# Altium schematic sheet shift.SchDoc
size A1
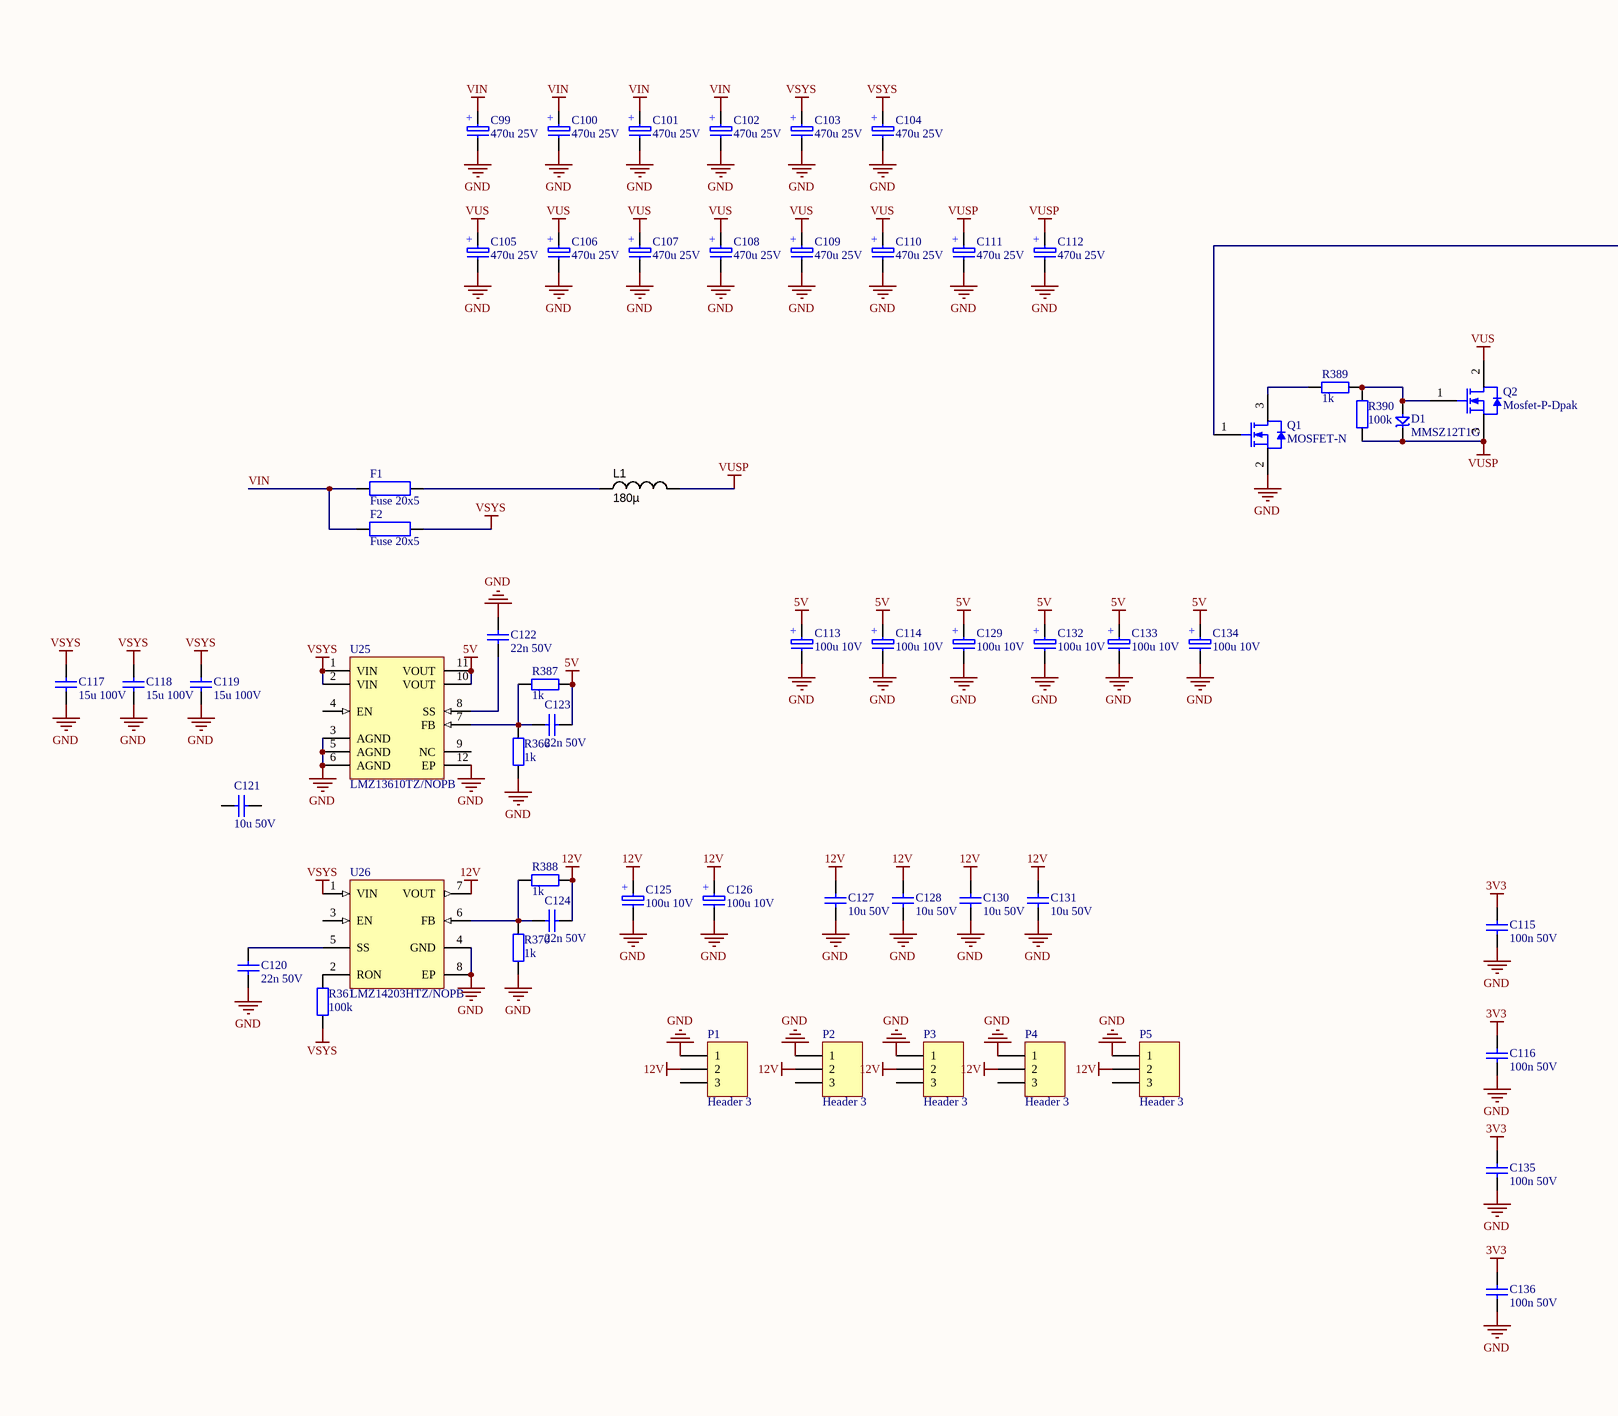
[diagram p0: shift.SchDoc, left]
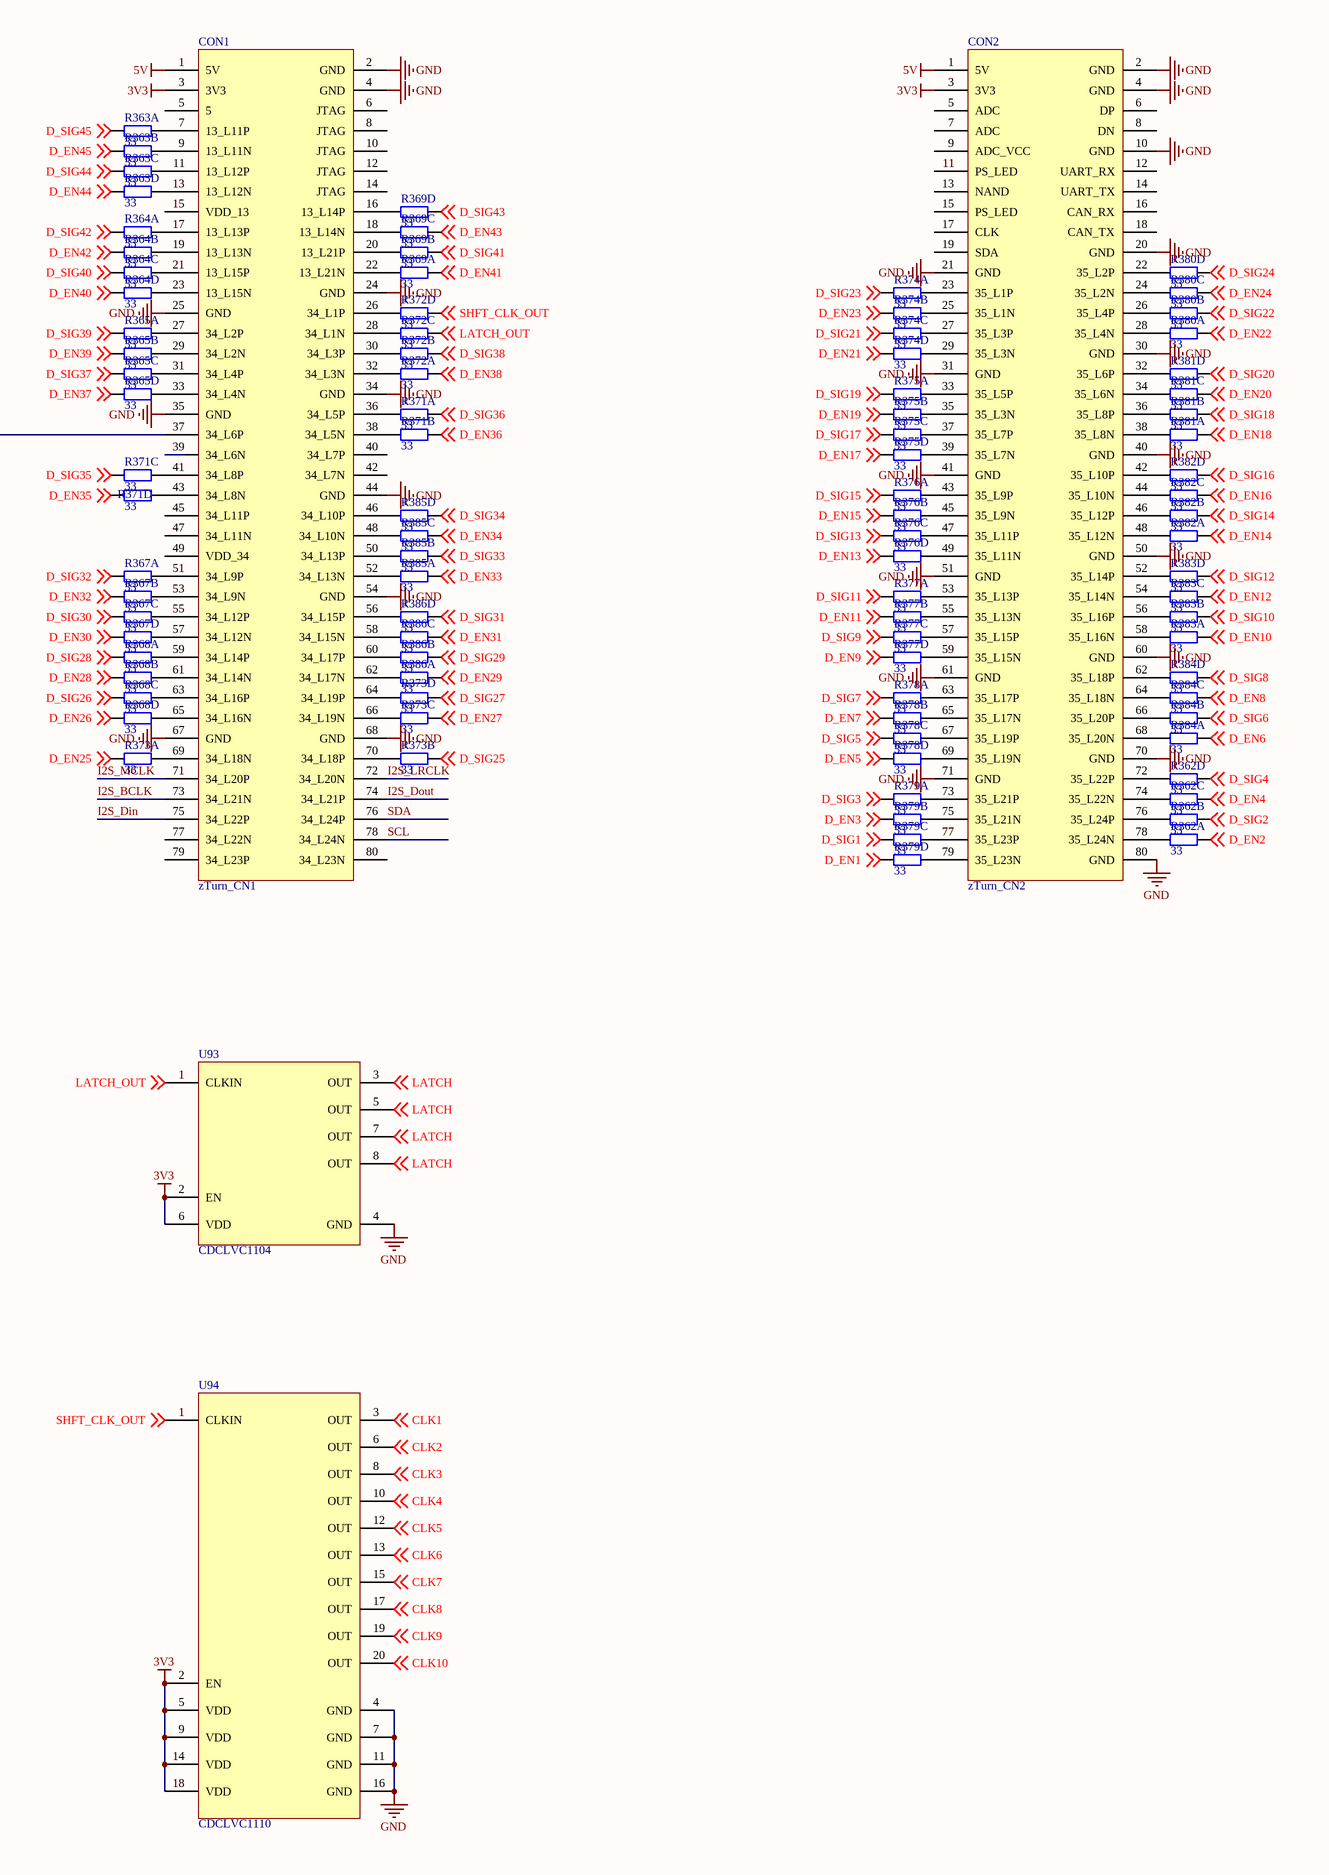
[diagram p1: shift.SchDoc, right]

## Parts
C99  470u 25V  [SMD-10x10]
C100  470u 25V  [SMD-10x10]
C101  470u 25V  [SMD-10x10]
C102  470u 25V  [SMD-10x10]
C103  470u 25V  [SMD-10x10]
C104  470u 25V  [SMD-10x10]
C105  470u 25V  [SMD-10x10]
C106  470u 25V  [SMD-10x10]
C107  470u 25V  [SMD-10x10]
C108  470u 25V  [SMD-10x10]
C109  470u 25V  [SMD-10x10]
C110  470u 25V  [SMD-10x10]
C111  470u 25V  [SMD-10x10]
C112  470u 25V  [SMD-10x10]
C113  100u 10V  [C-TANT-C 2.8mm]
C114  100u 10V  [C-TANT-C 2.8mm]
C115  100n 50V  [C-0603-M]
C116  100n 50V  [C-0603-M]
C117  15u 100V  [C-2220]
C118  15u 100V  [C-2220]
C119  15u 100V  [C-2220]
C120  22n 50V  [C-0603-H]
C121  10u 50V  [C-1206-H]
C122  22n 50V  [C-0603-H]
C123  22n 50V  [C-0603-H]
C124  22n 50V  [C-0603-H]
C125  100u 10V  [C-TANT-C 2.8mm]
C126  100u 10V  [C-TANT-C 2.8mm]
C127  10u 50V  [C-1206-H]
C128  10u 50V  [C-1206-H]
C129  100u 10V  [C-TANT-C 2.8mm]
C130  10u 50V  [C-1206-H]
C131  10u 50V  [C-1206-H]
C132  100u 10V  [C-TANT-C 2.8mm]
C133  100u 10V  [C-TANT-C 2.8mm]
C134  100u 10V  [C-TANT-C 2.8mm]
C135  100n 50V  [C-0603-M]
C136  100n 50V  [C-0603-M]
CON1  zTurn_CN1  [zTurn]
CON2  zTurn_CN2  [zTurn]
D1  MMSZ12T1G  [SOD123]
F1  Fuse 20x5  [FUSE-22.5]
F2  Fuse 20x5  [FUSE-22.5]
L1  value 180µ  [IND_SMD_TOROID_1.2x1.0in]  (hidden comment: INDC_180u_Toroid)
P1  Header 3  [HDR1X3]
P2  Header 3  [HDR1X3]
P3  Header 3  [HDR1X3]
P4  Header 3  [HDR1X3]
P5  Header 3  [HDR1X3]
Q1  MOSFET-N  [SOT-23]
Q2  Mosfet-P-Dpak  [DPAK]
R361  100k  [R-0603-H]
R362  33  [CAC-50P200X100-8N]  (parts A,B,C,D of 4)
R363  33  [CAC-50P200X100-8N]  (parts A,B,C,D of 4)
R364  33  [CAC-50P200X100-8N]  (parts A,B,C,D of 4)
R365  33  [CAC-50P200X100-8N]  (parts A,B,C,D of 4)
R366  1k  [R-0603-H]
R367  33  [CAC-50P200X100-8N]  (parts A,B,C,D of 4)
R368  33  [CAC-50P200X100-8N]  (parts A,B,C,D of 4)
R369  33  [CAC-50P200X100-8N]  (parts A,B,C,D of 4)
R370  1k  [R-0603-H]
R371  33  [CAC-50P200X100-8N]  (parts A,B,C,D of 4)
R372  33  [CAC-50P200X100-8N]  (parts A,B,C,D of 4)
R373  33  [CAC-50P200X100-8N]  (parts A,B,C,D of 4)
R374  33  [CAC-50P200X100-8N]  (parts A,B,C,D of 4)
R375  33  [CAC-50P200X100-8N]  (parts A,B,C,D of 4)
R376  33  [CAC-50P200X100-8N]  (parts A,B,C,D of 4)
R377  33  [CAC-50P200X100-8N]  (parts A,B,C,D of 4)
R378  33  [CAC-50P200X100-8N]  (parts A,B,C,D of 4)
R379  33  [CAC-50P200X100-8N]  (parts A,B,C,D of 4)
R380  33  [CAC-50P200X100-8N]  (parts A,B,C,D of 4)
R381  33  [CAC-50P200X100-8N]  (parts A,B,C,D of 4)
R382  33  [CAC-50P200X100-8N]  (parts A,B,C,D of 4)
R383  33  [CAC-50P200X100-8N]  (parts A,B,C,D of 4)
R384  33  [CAC-50P200X100-8N]  (parts A,B,C,D of 4)
R385  33  [CAC-50P200X100-8N]  (parts A,B,C,D of 4)
R386  33  [CAC-50P200X100-8N]  (parts A,B,C,D of 4)
R387  1k  [R-0603-H]
R388  1k  [R-0603-H]
R389  1k  [R-0603-H]
R390  100k  [R-0603-H]
U25  LMZ13610TZ/NOPB  [NDY0011A_M]
U26  LMZ14203HTZ/NOPB  [NDW0007A_V]
U93  CDCLVC1104  [TSSOP65P640X120-8N]
U94  CDCLVC1110  [TSSOP20]

## Nets
3V3: C115.2 C116.2 C135.2 C136.2 CON1.3(3V3) CON2.3(3V3) U93.2(EN) U93.6(VDD) U94.2(EN) U94.5(VDD) U94.9(VDD) U94.14(VDD) U94.18(VDD)
5V: C113.2 C114.2 C123.2 C129.2 C132.2 C133.2 C134.2 CON1.1(5V) CON2.1(5V) R387.2 U25.10(VOUT) U25.11(VOUT)
12V: C124.2 C125.2 C126.2 C127.1 C128.1 C130.1 C131.1 P1.2 P2.2 P3.2 P4.2 P5.2 R388.2 U26.7(VOUT)
GND: C99.1 C100.1 C101.1 C102.1 C103.1 C104.1 C105.1 C106.1 C107.1 C108.1 C109.1 C110.1 C111.1 C112.1 C113.1 C114.1 C115.1 C116.1 C117.1 C118.1 C119.1 C120.1 C122.1 C125.1 C126.1 C127.2 C128.2 C129.1 C130.2 C131.2 C132.1 C133.1 C134.1 C135.1 C136.1 CON1.2(GND) CON1.4(GND) CON1.24(GND) CON1.25(GND) CON1.34(GND) CON1.35(GND) CON1.44(GND) CON1.54(GND) CON1.67(GND) CON1.68(GND) CON2.2(GND) CON2.4(GND) CON2.10(GND) CON2.20(GND) CON2.21(GND) CON2.30(GND) CON2.31(GND) CON2.40(GND) CON2.41(GND) CON2.50(GND) CON2.51(GND) CON2.60(GND) CON2.61(GND) CON2.70(GND) CON2.71(GND) CON2.80(GND) P1.1 P2.1 P3.1 P4.1 P5.1 Q1.2 R366.1 R370.1 U25.3(AGND) U25.5(AGND) U25.6(AGND) U25.12(EP) U26.4(GND) U26.8(EP) U93.4(GND) U94.4(GND) U94.7(GND) U94.11(GND) U94.16(GND)
VIN: C99.2 C100.2 C101.2 C102.2 F1.1(V+) F2.1(V+)
VSYS: C103.2 C104.2 C117.2 C118.2 C119.2 F2.2(V+) R361.1 U25.1(VIN) U25.2(VIN) U26.1(VIN)
VUS: C105.2 C106.2 C107.2 C108.2 C109.2 C110.2 Q2.2
VUSP: C111.2 C112.2 D1.2(kt) L1.2 Q2.3 R390.1
CLK1: U94.3(OUT) ; off-sheet CLK1
CLK2: U94.6(OUT) ; off-sheet CLK2
CLK3: U94.8(OUT) ; off-sheet CLK3
CLK4: U94.10(OUT) ; off-sheet CLK4
CLK5: U94.12(OUT) ; off-sheet CLK5
CLK6: U94.13(OUT) ; off-sheet CLK6
CLK7: U94.15(OUT) ; off-sheet CLK7
CLK8: U94.17(OUT) ; off-sheet CLK8
CLK9: U94.19(OUT) ; off-sheet CLK9
CLK10: U94.20(OUT) ; off-sheet CLK10
D_EN1: R379.5 ; off-sheet D_EN1
D_EN2: R362.8 ; off-sheet D_EN2
D_EN3: R379.7 ; off-sheet D_EN3
D_EN4: R362.6 ; off-sheet D_EN4
D_EN5: R378.5 ; off-sheet D_EN5
D_EN6: R384.8 ; off-sheet D_EN6
D_EN7: R378.7 ; off-sheet D_EN7
D_EN8: R384.6 ; off-sheet D_EN8
D_EN9: R377.5 ; off-sheet D_EN9
D_EN10: R383.8 ; off-sheet D_EN10
D_EN11: R377.7 ; off-sheet D_EN11
D_EN12: R383.6 ; off-sheet D_EN12
D_EN13: R376.5 ; off-sheet D_EN13
D_EN14: R382.8 ; off-sheet D_EN14
D_EN15: R376.7 ; off-sheet D_EN15
D_EN16: R382.6 ; off-sheet D_EN16
D_EN17: R375.5 ; off-sheet D_EN17
D_EN18: R381.8 ; off-sheet D_EN18
D_EN19: R375.7 ; off-sheet D_EN19
D_EN20: R381.6 ; off-sheet D_EN20
D_EN21: R374.5 ; off-sheet D_EN21
D_EN22: R380.8 ; off-sheet D_EN22
D_EN23: R374.7 ; off-sheet D_EN23
D_EN24: R380.6 ; off-sheet D_EN24
D_EN25: R373.8 ; off-sheet D_EN25
D_EN26: R368.5 ; off-sheet D_EN26
D_EN27: R373.6 ; off-sheet D_EN27
D_EN28: R368.7 ; off-sheet D_EN28
D_EN29: R386.8 ; off-sheet D_EN29
D_EN30: R367.5 ; off-sheet D_EN30
D_EN31: R386.6 ; off-sheet D_EN31
D_EN32: R367.7 ; off-sheet D_EN32
D_EN33: R385.8 ; off-sheet D_EN33
D_EN34: R385.6 ; off-sheet D_EN34
D_EN35: R371.5 ; off-sheet D_EN35
D_EN36: R371.2 ; off-sheet D_EN36
D_EN37: R365.5 ; off-sheet D_EN37
D_EN38: R372.8 ; off-sheet D_EN38
D_EN39: R365.7 ; off-sheet D_EN39
D_EN40: R364.5 ; off-sheet D_EN40
D_EN41: R369.8 ; off-sheet D_EN41
D_EN42: R364.7 ; off-sheet D_EN42
D_EN43: R369.6 ; off-sheet D_EN43
D_EN44: R363.5 ; off-sheet D_EN44
D_EN45: R363.7 ; off-sheet D_EN45
D_SIG1: R379.6 ; off-sheet D_SIG1
D_SIG2: R362.7 ; off-sheet D_SIG2
D_SIG3: R379.8 ; off-sheet D_SIG3
D_SIG4: R362.5 ; off-sheet D_SIG4
D_SIG5: R378.6 ; off-sheet D_SIG5
D_SIG6: R384.7 ; off-sheet D_SIG6
D_SIG7: R378.8 ; off-sheet D_SIG7
D_SIG8: R384.5 ; off-sheet D_SIG8
D_SIG9: R377.6 ; off-sheet D_SIG9
D_SIG10: R383.7 ; off-sheet D_SIG10
D_SIG11: R377.8 ; off-sheet D_SIG11
D_SIG12: R383.5 ; off-sheet D_SIG12
D_SIG13: R376.6 ; off-sheet D_SIG13
D_SIG14: R382.7 ; off-sheet D_SIG14
D_SIG15: R376.8 ; off-sheet D_SIG15
D_SIG16: R382.5 ; off-sheet D_SIG16
D_SIG17: R375.6 ; off-sheet D_SIG17
D_SIG18: R381.7 ; off-sheet D_SIG18
D_SIG19: R375.8 ; off-sheet D_SIG19
D_SIG20: R381.5 ; off-sheet D_SIG20
D_SIG21: R374.6 ; off-sheet D_SIG21
D_SIG22: R380.7 ; off-sheet D_SIG22
D_SIG23: R374.8 ; off-sheet D_SIG23
D_SIG24: R380.5 ; off-sheet D_SIG24
D_SIG25: R373.7 ; off-sheet D_SIG25
D_SIG26: R368.6 ; off-sheet D_SIG26
D_SIG27: R373.5 ; off-sheet D_SIG27
D_SIG28: R368.8 ; off-sheet D_SIG28
D_SIG29: R386.7 ; off-sheet D_SIG29
D_SIG30: R367.6 ; off-sheet D_SIG30
D_SIG31: R386.5 ; off-sheet D_SIG31
D_SIG32: R367.8 ; off-sheet D_SIG32
D_SIG33: R385.7 ; off-sheet D_SIG33
D_SIG34: R385.5 ; off-sheet D_SIG34
D_SIG35: R371.6 ; off-sheet D_SIG35
D_SIG36: R371.1 ; off-sheet D_SIG36
D_SIG37: R365.6 ; off-sheet D_SIG37
D_SIG38: R372.7 ; off-sheet D_SIG38
D_SIG39: R365.8 ; off-sheet D_SIG39
D_SIG40: R364.6 ; off-sheet D_SIG40
D_SIG41: R369.7 ; off-sheet D_SIG41
D_SIG42: R364.8 ; off-sheet D_SIG42
D_SIG43: R369.5 ; off-sheet D_SIG43
D_SIG44: R363.6 ; off-sheet D_SIG44
D_SIG45: R363.8 ; off-sheet D_SIG45
I2S_BCLK: CON1.73(34_L21N)
I2S_Din: CON1.75(34_L22P)
I2S_Dout: CON1.74(34_L21P)
I2S_LRCLK: CON1.72(34_L20N)
I2S_MCLK: CON1.71(34_L20P)
LATCH: U93.3(OUT) U93.5(OUT) U93.7(OUT) U93.8(OUT) ; off-sheet LATCH
LATCH_OUT: R372.6 U93.1(CLKIN) ; off-sheet LATCH_OUT
SCL: CON1.78(34_L24N)
SDA: CON1.76(34_L24P)
SHFT_CLK_OUT: R372.5 U94.1(CLKIN) ; off-sheet SHFT_CLK_OUT
NetC120_2: C120.2 U26.5(SS)
NetC122_2: C122.2 U25.8(SS)
NetC123_1: C123.1 R366.2 R387.1 U25.7(FB)
NetC124_1: C124.1 R370.2 R388.1 U26.6(FB)
NetCON1_7: CON1.7(13_L11P) R363.1
NetCON1_9: CON1.9(13_L11N) R363.2
NetCON1_11: CON1.11(13_L12P) R363.3
NetCON1_13: CON1.13(13_L12N) R363.4
NetCON1_16: CON1.16(13_L14P) R369.4
NetCON1_17: CON1.17(13_L13P) R364.1
NetCON1_18: CON1.18(13_L14N) R369.3
NetCON1_19: CON1.19(13_L13N) R364.2
NetCON1_20: CON1.20(13_L21P) R369.2
NetCON1_21: CON1.21(13_L15P) R364.3
NetCON1_22: CON1.22(13_L21N) R369.1
NetCON1_23: CON1.23(13_L15N) R364.4
NetCON1_26: CON1.26(34_L1P) R372.4
NetCON1_27: CON1.27(34_L2P) R365.1
NetCON1_28: CON1.28(34_L1N) R372.3
NetCON1_29: CON1.29(34_L2N) R365.2
NetCON1_30: CON1.30(34_L3P) R372.2
NetCON1_31: CON1.31(34_L4P) R365.3
NetCON1_32: CON1.32(34_L3N) R372.1
NetCON1_33: CON1.33(34_L4N) R365.4
NetCON1_36: CON1.36(34_L5P) R371.8
NetCON1_37: CON1.37(34_L6P) Q1.1
NetCON1_38: CON1.38(34_L5N) R371.7
NetCON1_41: CON1.41(34_L8P) R371.3
NetCON1_43: CON1.43(34_L8N) R371.4
NetCON1_46: CON1.46(34_L10P) R385.4
NetCON1_48: CON1.48(34_L10N) R385.3
NetCON1_50: CON1.50(34_L13P) R385.2
NetCON1_51: CON1.51(34_L9P) R367.1
NetCON1_52: CON1.52(34_L13N) R385.1
NetCON1_53: CON1.53(34_L9N) R367.2
NetCON1_55: CON1.55(34_L12P) R367.3
NetCON1_56: CON1.56(34_L15P) R386.4
NetCON1_57: CON1.57(34_L12N) R367.4
NetCON1_58: CON1.58(34_L15N) R386.3
NetCON1_59: CON1.59(34_L14P) R368.1
NetCON1_60: CON1.60(34_L17P) R386.2
NetCON1_61: CON1.61(34_L14N) R368.2
NetCON1_62: CON1.62(34_L17N) R386.1
NetCON1_63: CON1.63(34_L16P) R368.3
NetCON1_64: CON1.64(34_L19P) R373.4
NetCON1_65: CON1.65(34_L16N) R368.4
NetCON1_66: CON1.66(34_L19N) R373.3
NetCON1_69: CON1.69(34_L18N) R373.1
NetCON1_70: CON1.70(34_L18P) R373.2
NetCON2_22: CON2.22(35_L2P) R380.4
NetCON2_23: CON2.23(35_L1P) R374.1
NetCON2_24: CON2.24(35_L2N) R380.3
NetCON2_25: CON2.25(35_L1N) R374.2
NetCON2_26: CON2.26(35_L4P) R380.2
NetCON2_27: CON2.27(35_L3P) R374.3
NetCON2_28: CON2.28(35_L4N) R380.1
NetCON2_29: CON2.29(35_L3N) R374.4
NetCON2_32: CON2.32(35_L6P) R381.4
NetCON2_33: CON2.33(35_L5P) R375.1
NetCON2_34: CON2.34(35_L6N) R381.3
NetCON2_35: CON2.35(35_L3N) R375.2
NetCON2_36: CON2.36(35_L8P) R381.2
NetCON2_37: CON2.37(35_L7P) R375.3
NetCON2_38: CON2.38(35_L8N) R381.1
NetCON2_39: CON2.39(35_L7N) R375.4
NetCON2_42: CON2.42(35_L10P) R382.4
NetCON2_43: CON2.43(35_L9P) R376.1
NetCON2_44: CON2.44(35_L10N) R382.3
NetCON2_45: CON2.45(35_L9N) R376.2
NetCON2_46: CON2.46(35_L12P) R382.2
NetCON2_47: CON2.47(35_L11P) R376.3
NetCON2_48: CON2.48(35_L12N) R382.1
NetCON2_49: CON2.49(35_L11N) R376.4
NetCON2_52: CON2.52(35_L14P) R383.4
NetCON2_53: CON2.53(35_L13P) R377.1
NetCON2_54: CON2.54(35_L14N) R383.3
NetCON2_55: CON2.55(35_L13N) R377.2
NetCON2_56: CON2.56(35_L16P) R383.2
NetCON2_57: CON2.57(35_L15P) R377.3
NetCON2_58: CON2.58(35_L16N) R383.1
NetCON2_59: CON2.59(35_L15N) R377.4
NetCON2_62: CON2.62(35_L18P) R384.4
NetCON2_63: CON2.63(35_L17P) R378.1
NetCON2_64: CON2.64(35_L18N) R384.3
NetCON2_65: CON2.65(35_L17N) R378.2
NetCON2_66: CON2.66(35_L20P) R384.2
NetCON2_67: CON2.67(35_L19P) R378.3
NetCON2_68: CON2.68(35_L20N) R384.1
NetCON2_69: CON2.69(35_L19N) R378.4
NetCON2_72: CON2.72(35_L22P) R362.4
NetCON2_73: CON2.73(35_L21P) R379.1
NetCON2_74: CON2.74(35_L22N) R362.3
NetCON2_75: CON2.75(35_L21N) R379.2
NetCON2_76: CON2.76(35_L24P) R362.2
NetCON2_77: CON2.77(35_L23P) R379.3
NetCON2_78: CON2.78(35_L24N) R362.1
NetCON2_79: CON2.79(35_L23N) R379.4
NetD1_1: D1.1(an) Q2.1 R389.2 R390.2
NetF1_2: F1.2(V+) L1.1
NetQ1_3: Q1.3 R389.1
NetR361_2: R361.2 U26.2(RON)

Not connected (* = marked no-connect by the designer): C121 1 2; CON1 5 6(JTAG) 8(JTAG) 10(JTAG) 12(JTAG) 14(JTAG) 15(VDD_13) 39(34_L6N) 40(34_L7P) 42(34_L7N) 45(34_L11P) 47(34_L11N) 49(VDD_34) 77(34_L22N) 79(34_L23P) 80(34_L23N); CON2 5(ADC) 6(DP) 7(ADC) 8(DN) 9(ADC_VCC) 11(PS_LED) 12(UART_RX) 13(NAND) 14(UART_TX) 15(PS_LED) 16(CAN_RX) 17(CLK) 18(CAN_TX) 19(SDA); P1 3; P2 3; P3 3; P4 3; P5 3; U25 4(EN) 9(NC); U26 3(EN)

## Notes on the sheet
- (in symbol C-TANT-100u-10V) +
- (in symbol CE-SMD-470u-25V) +

## Library data of the parts
C99-C112 = CE-SMD-470u-25V: electrolytic capacitor 470u 25V; Supplier 1: Mouser; Supplier Part Number 1: 647-UWD1E471MCL1
C113 C114 C125 C126 C129 C132-C134 = C-TANT-100u-10V: Capacitor Tantalum 100uF 10V; Supplier 1: Mouser; Supplier Part Number 1: 80-T520C107M10ATE25
C115 C116 C135 C136 = C-0603-100n-50V: Capacitor 100n 50V; Supplier 1: Mouser; Supplier Part Number 1: 80-C0603C104K5RAUTO
C117-C119 = C-2220-15u-100V: Capacitor 15uF 100V; Supplier 1: Mouser; Supplier Part Number 1: 810-C5750X7S2A156M
C120 C122-C124 = C-0603-22n-50V: Capacitor 22nF 50V; Supplier 1: Mouser; Supplier Part Number 1: 80-C0603C223K5RAC
C121 C127 C128 C130 C131 = C-1206-10u-50V: Capacitor 10uF 50V; Supplier 1: Mouser; Supplier Part Number 1: 810-C3216X5R1H106M
D1 = Diode-Zener-12V: Supplier 1: Mouser; Supplier Part Number 1: 863-MMSZ12T1G
F1 F2 = FUSE-20x5: Supplier 1: Mouser; Supplier Part Number 1: 693-0031.8201
L1 = INDC_180u_Toroid: Power Inductor 180µH 10% SMD Toroid; Manufacturer 1: JW Miller A Bourns Company; Manufacturer Part Number 1: PM2110-181K-RC; Ratings: 3.7A; SCDType: spec; Package / Case: 1.200" L x 1.000" W x 0.530" H; Tolerance: ±10%; Supplier 1: Digi-Key; Supplier Part Number 1: M8769-ND; Current: 3.7A
P1-P5 = Header 3: Header, 3-Pin; LatestRevisionDate: 17-Jul-2002; LatestRevisionNote: Re-released for DXP Platform.; Publisher: Altium Limited
Q2 = Mosfet-N-Dpak
R361 R390 = R-0603-100k: Resistor 100k; Supplier 1: Mouser; Supplier Part Number 1: 71-CRCW0603-100K-E3
R362-R365 R367-R369 R371-R386 = R-4x33: Resistor Array 4x33; Supplier 1: Mouser; Supplier Part Number 1: 667-EXB-N8V330JX
R366 R370 R387-R389 = R-0603-1k: Resistor 1k; Supplier 1: Mouser; Supplier Part Number 1: 71-CRCW0603-1.0K-E3
U25 = CMP-0069-02080-2: 10A SIMPLE SWITCHER® Power Module with 36V Maximum Input Voltage, 11 pin TO-PMOD, 32 Rail; Manufacturer: Texas Instruments; PackageTopMarking: NSUZXYTTE#*LMZ13610; PowerWise: N; ComponentLink1Description: Datasheet URL; RoHS: Y; CompType: Switcher; ComponentLink1URL: http://www.ti.com/general/docs/lit/getliterature.tsp?genericPartNumber=LMZ13610&fileType=pdf; PackageReference: NDY0011A; PackageDescription: TO-PMOD, 15 x 15 x 5.9 mm Body, 11 Lead, 1.27 mm Pitch, Surface Mount; PinCount: 11
U26 = CMP-0069-02044-2: 3A SIMPLE SWITCHER® Power Module with 42V Maximum Input for High Voltage Output, 7-pin TO-PMOD, Pb-Free, 250 Reel; Manufacturer: Texas Instruments; PowerWise: Y; PackageTopMarking: NSUZXYTTE#*LMZ14203*HTZ; PinCount: 7; PackageDescription: TO-PMOD-7, 10.16 x 9.85 x 4.57 mm Body, 7 Lead, 1.27mm Pitch, Surface Mount; ComponentLink1Description: Datasheet URL; PackageReference: NDW0007A; CompType: Switcher; ComponentLink1URL: http://www.ti.com/general/docs/lit/getliterature.tsp?genericPartNumber=LMZ14203H&fileType=pdf; RoHS: Y